# Altium schematic sheet H_bridge_PFC161.SchDoc
size A4
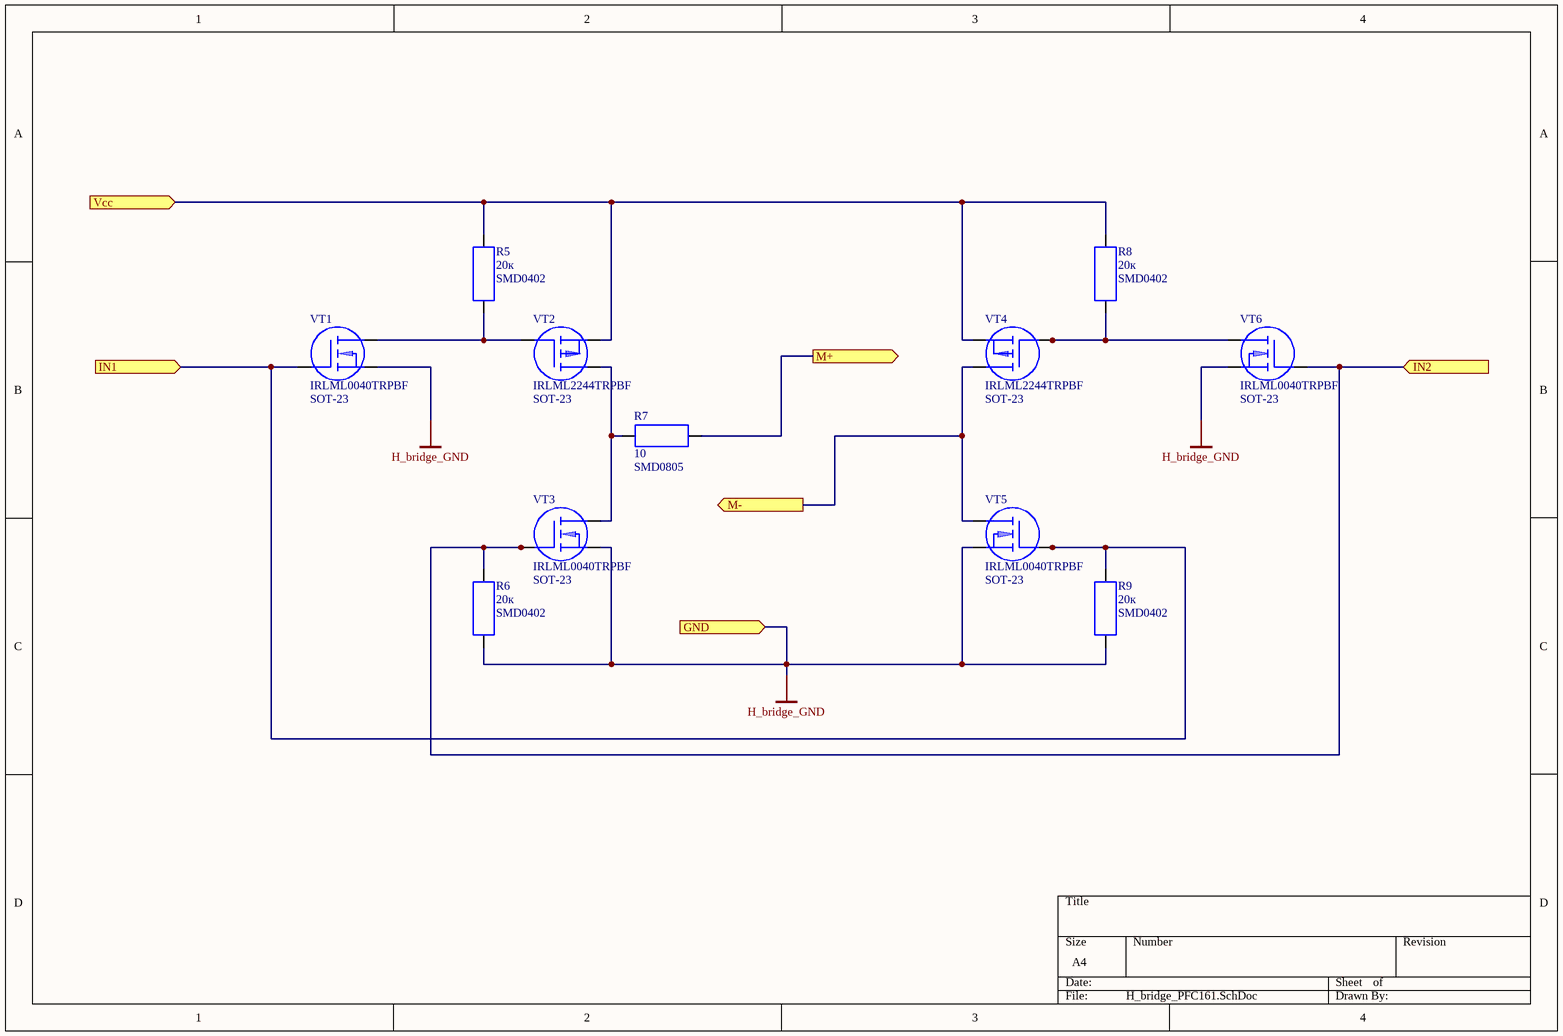
[diagram p0: H_bridge_PFC161.SchDoc]

## Parts
R5  20к  Package: SMD0402  [SMD0402(1608)]
R6  20к  Package: SMD0402  [SMD0402(1608)]
R7  10  Package: SMD0805  [SMD0805(2012)]
R8  20к  Package: SMD0402  [SMD0402(1608)]
R9  20к  Package: SMD0402  [SMD0402(1608)]
VT1  IRLML0040TRPBF  Package: SOT-23  [SOT23-3]
VT2  IRLML2244TRPBF  Package: SOT-23  [SOT23-3]
VT3  IRLML0040TRPBF  Package: SOT-23  [SOT23-3]
VT4  IRLML2244TRPBF  Package: SOT-23  [SOT23-3]
VT5  IRLML0040TRPBF  Package: SOT-23  [SOT23-3]
VT6  IRLML0040TRPBF  Package: SOT-23  [SOT23-3]

## Ports
GND (in), IN1 (in), IN2 (in), M+ (out), M- (out), Vcc (in)

## Nets
H_bridge_GND: R6.2 R9.2 VT1.2 VT3.2 VT5.2 VT6.2 ; port GND
IN1: R9.1 VT1.1 VT5.1 ; port IN1
IN2: R6.1 VT3.1 VT6.1 ; port IN2
M+: R7.1 ; port M+
M-: VT4.3 VT5.3 ; port M-
Vcc: R5.1 R8.1 VT2.2 VT4.2 ; port Vcc
NetR5_2: R5.2 VT1.3 VT2.1
NetR7_2: R7.2 VT2.3 VT3.3
NetR8_2: R8.2 VT4.1 VT6.3

## Library data of the parts
R5 R6 R8 R9 = R_0402: ValueBOM: Резистор 20кОм SMD 0402 1%; Type: R; Value: 20к
R7 = R_0805: ValueBOM: Резистор 10 Ом SMD 0805 1%; Type: R; Value: 10
VT1 VT3 VT5 VT6 = VT_N_MOSFET_SOT23_3: Type: VT; ValueBOM: Транзистор n-МОП IRLML0040TRPBF SOT23; Value: IRLML0040TRPBF
VT2 VT4 = VT_P_MOSFET_SOT23_3: Type: VT; ValueBOM: Транзистор p-МОП IRLML2244TRPBF SOT23; Value: IRLML2244TRPBF